# EAGLE design Mega (EAGLE 7.5.0)
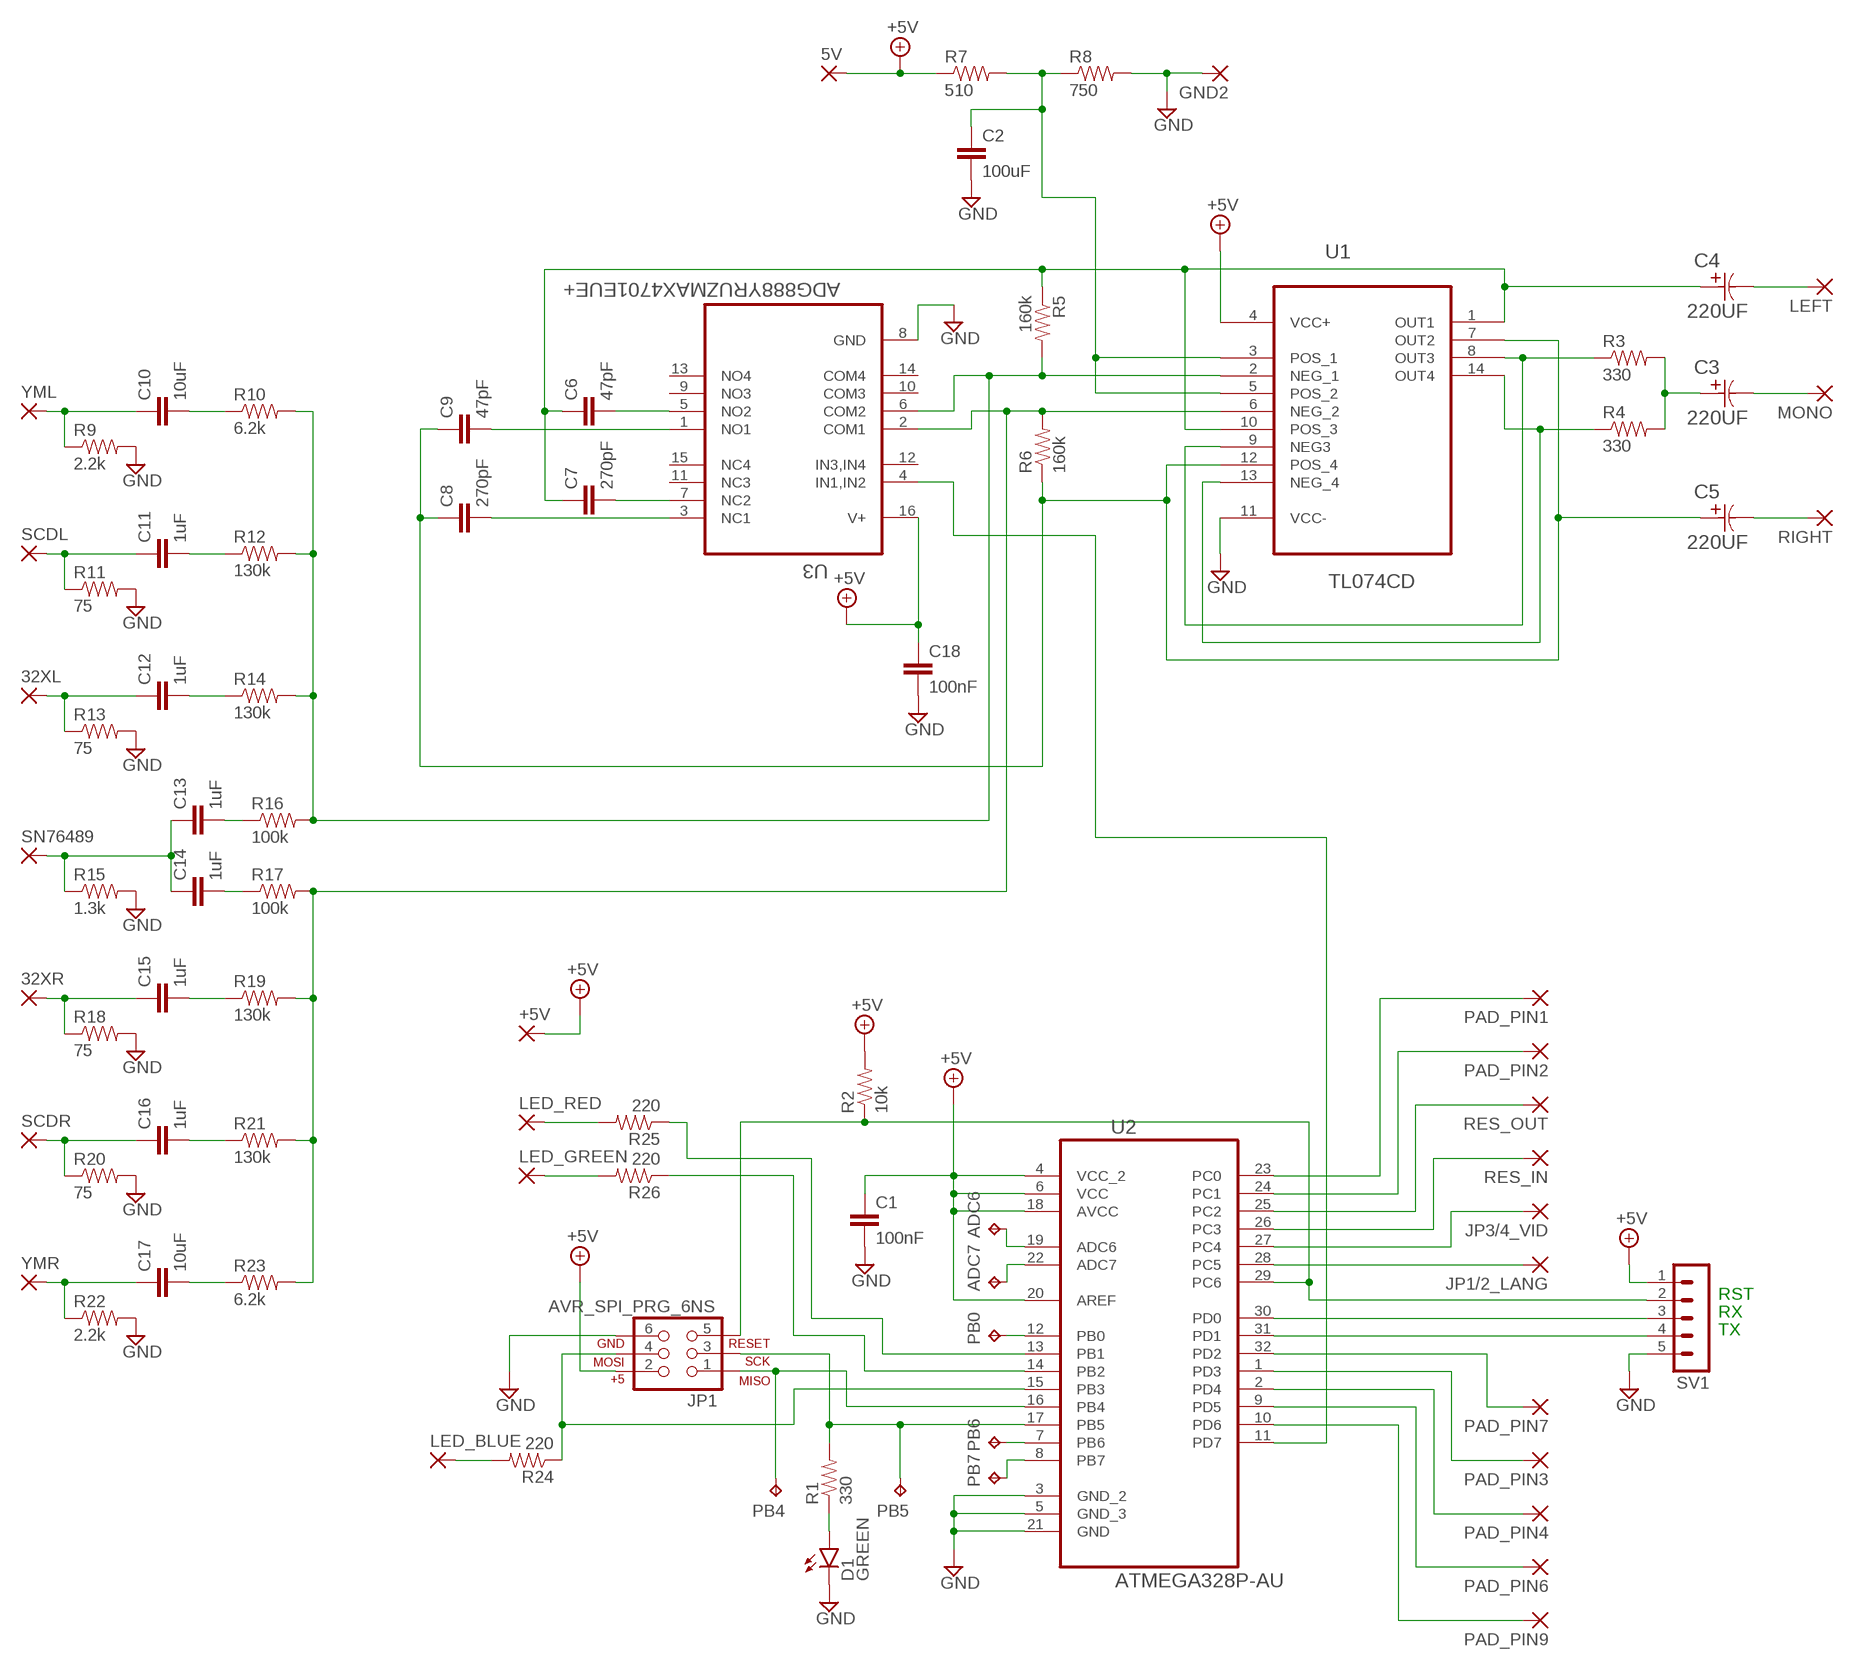
[diagram p0: schematic, sheet 1]

## Parts
5V  SMD2  [SMD1,27-2,54]
32XL  SMD2  [SMD1,27-2,54]
32XR  SMD2  [SMD1,27-2,54]
+5V  SMD2  [SMD1,27-2,54]
ADC6  TPB1,27  [B1,27]
ADC7  TPB1,27  [B1,27]
C1  100nF  CAP1206  [1206]
C2  100uF  CAP1206  [1206]
C3  220UF  EEE-FK1C221P-CASE-E  [CAPAE830X650N]
C4  220UF  EEE-FK1C221P-CASE-E  [CAPAE830X650N]
C5  220UF  EEE-FK1C221P-CASE-E  [CAPAE830X650N]
C6  47pF  CAP1206  [1206]
C7  270pF  CAP1206  [1206]
C8  270pF  CAP1206  [1206]
C9  47pF  CAP1206  [1206]
C10  10uF  CAP1206  [1206]
C11  1uF  CAP1206  [1206]
C12  1uF  CAP1206  [1206]
C13  1uF  CAP1206  [1206]
C14  1uF  CAP1206  [1206]
C15  1uF  CAP1206  [1206]
C16  1uF  CAP1206  [1206]
C17  10uF  CAP1206  [1206]
C18  100nF  CAP1206  [1206]
D1  GREEN  LED1206  [LED-1206]
GND2  SMD2  [SMD1,27-2,54]
JP1  AVR_SPI_PRG_6NS  [2X3-NS]
JP1/2_LANG  SMD2  [SMD1,27-2,54]
JP3/4_VID  SMD2  [SMD1,27-2,54]
LED_BLUE  SMD2  [SMD1,27-2,54]
LED_GREEN  SMD2  [SMD1,27-2,54]
LED_RED  SMD2  [SMD1,27-2,54]
LEFT  SMD2  [SMD1,27-2,54]
MONO  SMD2  [SMD1,27-2,54]
PAD_PIN1  SMD2  [SMD1,27-2,54]
PAD_PIN2  SMD2  [SMD1,27-2,54]
PAD_PIN3  SMD2  [SMD1,27-2,54]
PAD_PIN4  SMD2  [SMD1,27-2,54]
PAD_PIN6  SMD2  [SMD1,27-2,54]
PAD_PIN7  SMD2  [SMD1,27-2,54]
PAD_PIN9  SMD2  [SMD1,27-2,54]
PB0  TPB1,27  [B1,27]
PB4  TPB1,27  [B1,27]
PB5  TPB1,27  [B1,27]
PB6  TPB1,27  [B1,27]
PB7  TPB1,27  [B1,27]
R1  330  RESISTOR1206  [1206]
R2  10k  RESISTOR1206  [1206]
R3  330  RESISTOR1206  [1206]
R4  330  RESISTOR1206  [1206]
R5  160k  RESISTOR1206  [1206]
R6  160k  RESISTOR1206  [1206]
R7  510  RESISTOR1206  [1206]
R8  750  RESISTOR1206  [1206]
R9  2.2k  RESISTOR1206  [1206]
R10  6.2k  RESISTOR1206  [1206]
R11  75  RESISTOR1206  [1206]
R12  130k  RESISTOR1206  [1206]
R13  75  RESISTOR1206  [1206]
R14  130k  RESISTOR1206  [1206]
R15  1.3k  RESISTOR1206  [1206]
R16  100k  RESISTOR1206  [1206]
R17  100k  RESISTOR1206  [1206]
R18  75  RESISTOR1206  [1206]
R19  130k  RESISTOR1206  [1206]
R20  75  RESISTOR1206  [1206]
R21  130k  RESISTOR1206  [1206]
R22  2.2k  RESISTOR1206  [1206]
R23  6.2k  RESISTOR1206  [1206]
R24  220  RESISTOR1206  [1206]
R25  220  RESISTOR1206  [1206]
R26  220  RESISTOR1206  [1206]
RES_IN  SMD2  [SMD1,27-2,54]
RES_OUT  SMD2  [SMD1,27-2,54]
RIGHT  SMD2  [SMD1,27-2,54]
SCDL  SMD2  [SMD1,27-2,54]
SCDR  SMD2  [SMD1,27-2,54]
SN76489  SMD2  [SMD1,27-2,54]
SV1  MA05-1  [MA05-1]
U1  TL074CD  [SOIC127P600X175-14N]
U2  ATMEGA328P-AU  [QFP80P900X900X120-32N]
U3  ADG888YRUZMAX4701EUE+  [SOP65P640X120-16N]
YML  SMD2  [SMD1,27-2,54]
YMR  SMD2  [SMD1,27-2,54]

## Nets
+5V: 5V.1(P) +5V.1(P) C1.1 C18.1 JP1.2 R2.2 R7.1 SV1.1 U1.4(VCC+) U2.4(VCC_2) U2.6(VCC) U2.18(AVCC) U2.20(AREF) U3.16(V+)
GND: C1.2 C2.2 C18.2 D1.C GND2.1(P) JP1.6 R8.2 R9.2 R11.2 R13.2 R15.2 R18.2 R20.2 R22.2 SV1.5 U1.11(VCC-) U2.3(GND_2) U2.5(GND_3) U2.21(GND) U3.8(GND)
N$1: D1.A R1.1
N$2: JP1.3 PB5.TP R1.2 U2.17(PB5)
N$3: JP1.5 R2.1 SV1.2 U2.29(PC6)
N$4: JP1.1 PB4.TP U2.16(PB4)
N$5: JP1.4 R24.1 U2.15(PB3)
N$6: LED_RED.1(P) R25.2
N$7: LED_GREEN.1(P) R26.2
N$8: R3.1 U1.8(OUT3) U1.9(NEG3)
N$9: JP1/2_LANG.1(P) U2.28(PC5)
N$10: JP3/4_VID.1(P) U2.27(PC4)
N$11: R4.1 U1.13(NEG_4) U1.14(OUT4)
N$12: C3.1 R3.2 R4.2
N$13: C3.2 MONO.1(P)
N$14: C4.2 LEFT.1(P)
N$15: RES_IN.1(P) U2.26(PC3)
N$16: C4.1 C6.1 C7.1 R5.1 U1.1(OUT1) U1.10(POS_3)
N$17: C5.1 C8.1 C9.1 R6.1 U1.7(OUT2) U1.12(POS_4)
N$18: C5.2 RIGHT.1(P)
N$19: R6.2 R17.2 R19.2 R21.2 R23.2 U1.6(NEG_2) U3.2(COM1)
N$20: C6.2 U3.5(NO2)
N$21: C8.2 U3.3(NC1)
N$22: C7.2 U3.7(NC2)
N$23: C9.2 U3.1(NO1)
N$24: C10.1 R9.1 YML.1(P)
N$25: C2.1 R7.2 R8.1 U1.3(POS_1) U1.5(POS_2)
N$26: C10.2 R10.1
N$27: C11.1 R11.1 SCDL.1(P)
N$28: C11.2 R12.1
N$29: 32XL.1(P) C12.1 R13.1
N$30: C12.2 R14.1
N$31: C13.1 C14.1 R15.1 SN76489.1(P)
N$32: C13.2 R16.1
N$33: C17.1 R22.1 YMR.1(P)
N$34: C14.2 R17.1
N$35: 32XR.1(P) C15.1 R18.1
N$36: C15.2 R19.1
N$37: C16.1 R20.1 SCDR.1(P)
N$38: C16.2 R21.1
N$39: C17.2 R23.1
N$40: R5.2 R10.2 R12.2 R14.2 R16.2 U1.2(NEG_1) U3.6(COM2)
N$41: RES_OUT.1(P) U2.25(PC2)
N$42: PAD_PIN2.1(P) U2.24(PC1)
N$43: PAD_PIN1.1(P) U2.23(PC0)
N$44: SV1.4 U2.31(PD1)
N$45: SV1.3 U2.30(PD0)
N$46: PAD_PIN7.1(P) U2.32(PD2)
N$47: PAD_PIN3.1(P) U2.1(PD3)
N$48: PAD_PIN4.1(P) U2.2(PD4)
N$49: PAD_PIN6.1(P) U2.9(PD5)
N$50: PAD_PIN9.1(P) U2.10(PD6)
N$51: LED_BLUE.1(P) R24.2
N$52: R26.1 U2.14(PB2)
N$53: R25.1 U2.13(PB1)
N$54: ADC6.TP U2.19(ADC6)
N$55: ADC7.TP U2.22(ADC7)
N$56: PB0.TP U2.12(PB0)
N$57: PB6.TP U2.7(PB6)
N$58: PB7.TP U2.8(PB7)
N$59: U2.11(PD7) U3.4(IN1,IN2)
Unconnected: U3.9(NO3) U3.10(COM3) U3.11(NC3) U3.12(IN3,IN4) U3.13(NO4) U3.14(COM4) U3.15(NC4)

## Notes on the sheet
- RST
- RX
- TX

## Library data of the parts
5V 32XL 32XR +5V GND2 JP1/2_LANG JP3/4_VID LED_BLUE LED_GREEN LED_RED LEFT MONO PAD_PIN1-PAD_PIN4 PAD_PIN6 PAD_PIN7 PAD_PIN9 RES_IN RES_OUT RIGHT SCDL SCDR SN76489 YML YMR = wirepad:SMD2: SMD PAD
ADC6 ADC7 PB0 PB4-PB7 = testpad:TP: Test pad
C1 C2 C6-C18 = SparkFun-Capacitors:CAP: Capacitor Standard 0603 ceramic capacitor, and 0.1" leaded capacitor.
C3-C5 = 220uF_2106:EEE-: Aluminum Electrolytic Capacitors,Surface Mount Type; MPN: EEE-FK1C221P; OC_FARNELL: 9695680; OC_NEWARK: 96K9382; PACKAGE: CASE-E; SUPPLIER: PANASONIC; TOLERANCE: 20 %; VOLTAGERATING: 16V
D1 = SparkFun-LED:LED: LEDs Standard schematic elements and footprints for 5mm, 3mm, 1206, and 0603 sized LEDs. 5mm - Spark Fun Electronics SKU : COM-00529 (and others)
JP1 = SparkFun-Connectors:AVR_SPI_PRG_6: AVR ISP 6 Pin This is the reduced ISP connector for AVR programming. Common on Arduino. This footprint will take up less PCB space and can be used with a 10-pin to 6-pin adapter such as SKU: BOB-08508 **Special note about "TEST_POINT" package. The stop mask is on the top side, so if you want your programming test points to be on the bottom of your board, make sure to place this package on the bottom side of the board. This also ensure that the orientation to program from the bottom side will be correct.
R1-R26 = SparkFun-Resistors:RESISTOR: Resistor Basic schematic elements and footprints for 0603, 1206, and PTH resistors.
SV1 = con-lstb:MA05-1: PIN HEADER; OC_FARNELL: unknown; OC_NEWARK: unknown
U1 = TL074_SMD:TL074CD: Low noise JFET quad operational amplifier; MPN: TL074CD; OC_FARNELL: 1651878; OC_NEWARK: 89K1719; PACKAGE: SOIC-14; SUPPLIER: STMICROELECTRONICS
U2 = Atmega328P:ATMEGA328P-AU: 8-bit Microcontroller with In-System Programmable Flash; MPN: ATMEGA328P-AU; OC_FARNELL: 1715486; OC_NEWARK: 14R4631; PACKAGE: TQFP-32; SUPPLIER: Atmel
U3 = MAX4701EUE+:ADG888YRUZ: 0.4 Ù CMOS, Dual DPDT Switch

## Board
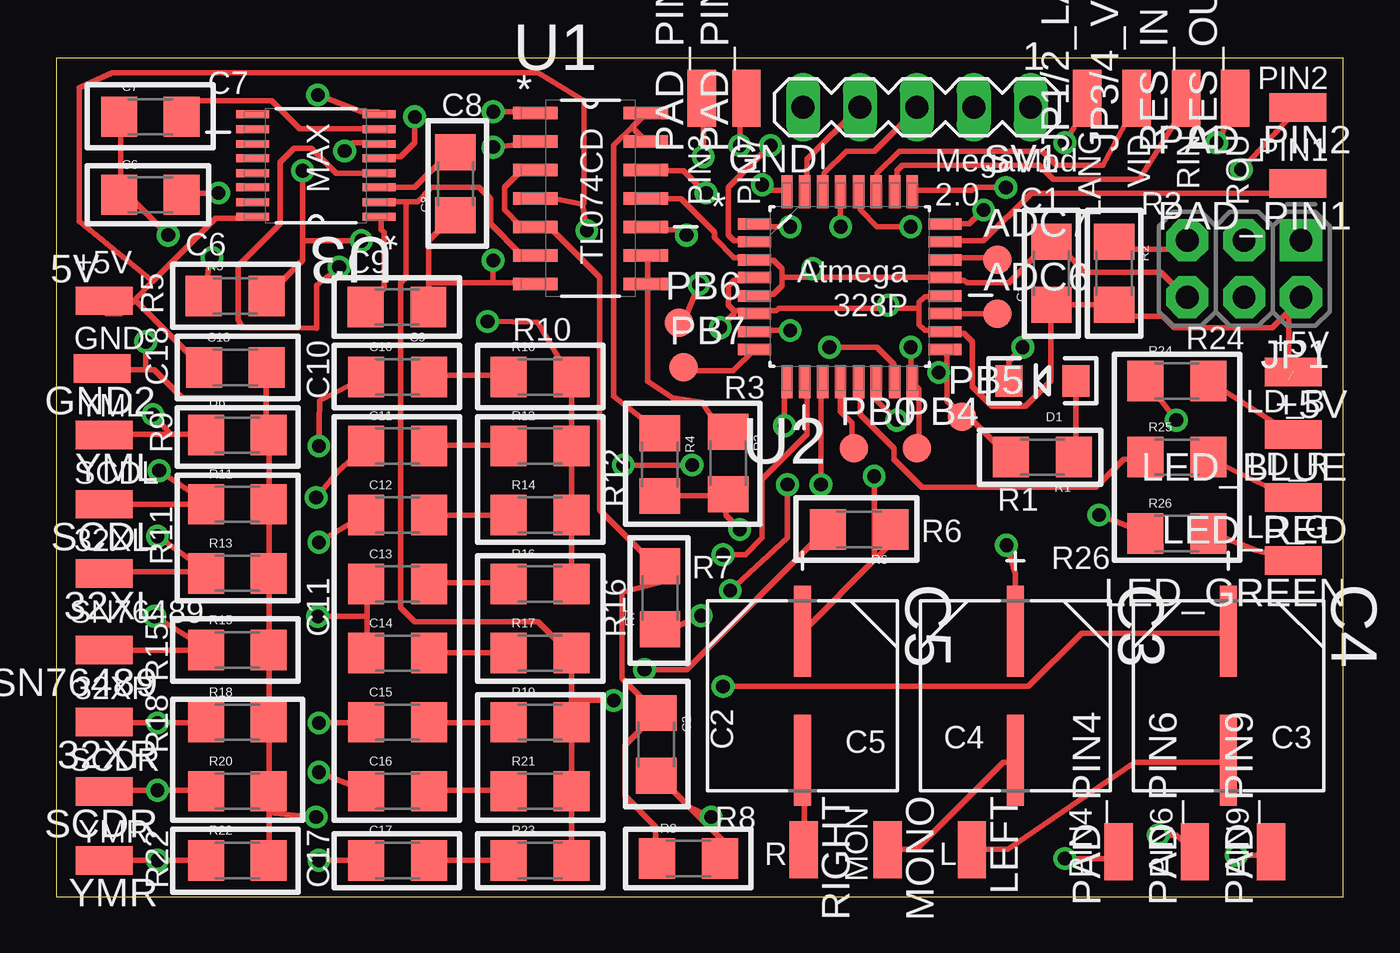
[diagram p1: board, top side]
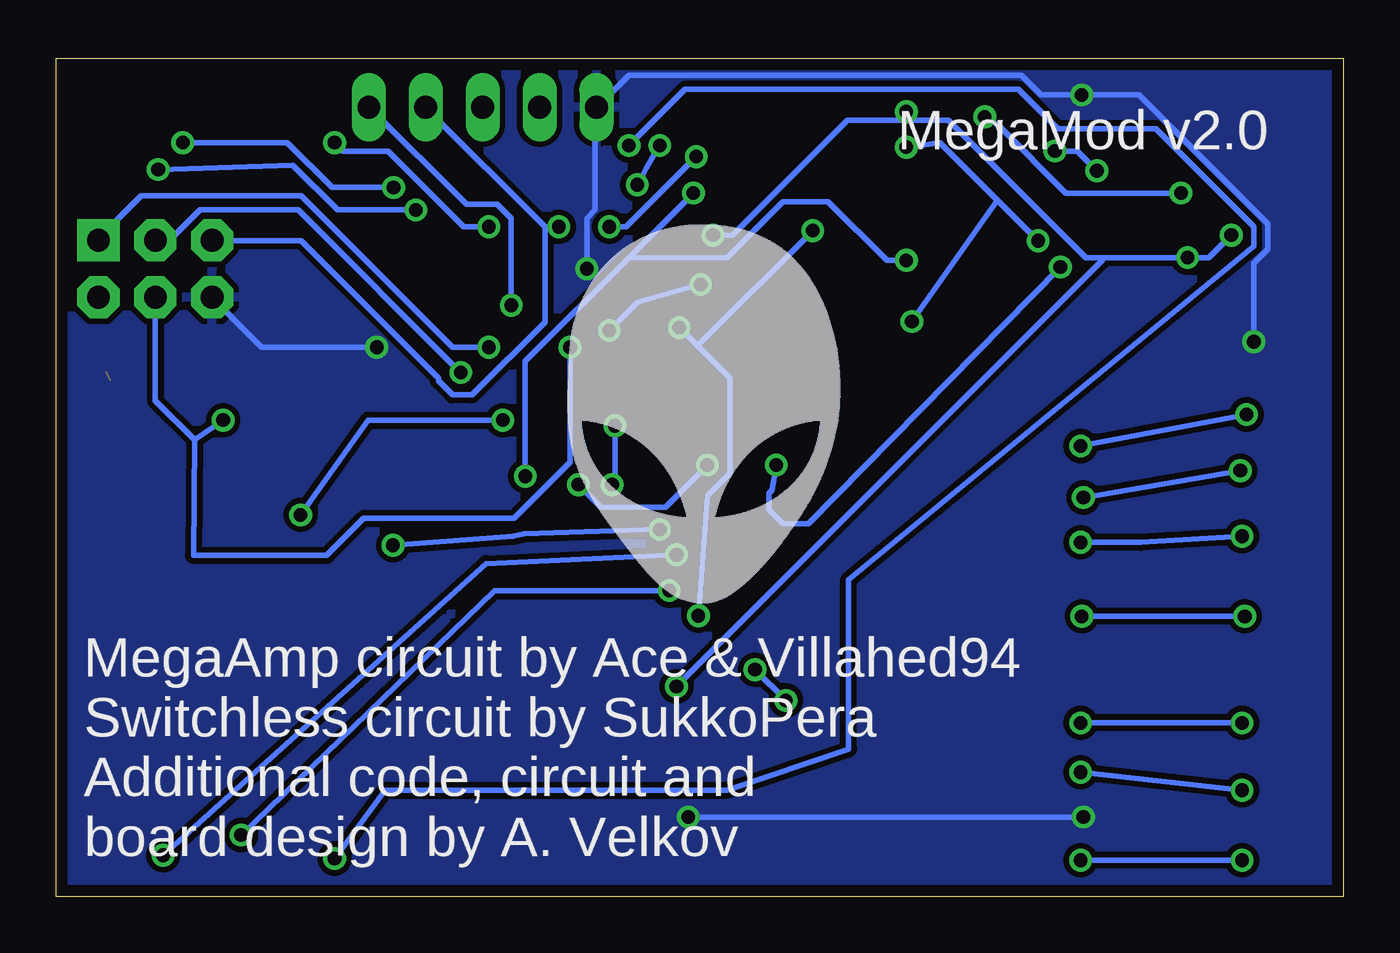
[diagram p2: board, bottom side, seen from below]

Size 57.43 x 37.39 mm. Coordinates in mm from the lower left corner, seen from the top.
Outline: 0,0 57.43,0 57.43,37.39 0,37.39 0,0
Copper layers (1*16): Top 0.035mm / dielectric 1.5mm / Bottom 0.035mm
Design rules "default *": minimum track width 10mil, minimum drill 24mil, track to track 10mil, track to pad 10mil, pad to pad 10mil, via to via 10mil, smd to smd 8mil, copper to edge 20mil, drill to drill 8mil, minimum pad ring 10mil, minimum via ring 8mil, stop-mask expansion 4mil, vias tented up to drill 25mil, thermal gap 10mil

### Footprints (pad centres in the part's own frame; a part is rotated, then mirrored left to right if it is on the bottom)
SMD1,27-2,54 = smd 1.27 x 2.54: 1 0,0
B1,27 = smd 1.27 x 1.27: TP 0,0
1206 = smd 1.6 x 1.8: 1 -1.4,0; 2 1.4,0
CAPAE830X650N = smd 4.064 x 0.762: 1 -2.87,0; 2 2.87,0
LED-1206 = smd 1.2 x 1.4: A -1.5,0; C 1.5,0
2X3-NS = drill 1.016 pad 1.88 square: 1 -2.54,-1.27 | drill 1.016 pad 1.88 octagon: 2 -2.54,1.27; 3 0,-1.27; 4 0,1.27; 5 2.54,-1.27; 6 2.54,1.27
MA05-1 = drill 1.016 long: 1 -5.08,0; 2 -2.54,0; 3 0,0; 4 2.54,0; 5 5.08,0
SOIC127P600X175-14N = smd 1.981 x 0.559: 1 -2.464,3.81; 2 -2.464,2.54; 3 -2.464,1.27; 4 -2.464,0; 5 -2.464,-1.27; 6 -2.464,-2.54; 7 -2.464,-3.81; 8 2.464,-3.81; 9 2.464,-2.54; 10 2.464,-1.27; 11 2.464,0; 12 2.464,1.27; 13 2.464,2.54; 14 2.464,3.81
QFP80P900X900X120-32N = smd 1.473 x 0.508: 1 -4.242,2.794; 2 -4.242,2.007; 3 -4.242,1.194; 4 -4.242,0.406; 5 -4.242,-0.406; 6 -4.242,-1.194; 7 -4.242,-2.007; 8 -4.242,-2.794; 17 4.242,-2.794; 18 4.242,-2.007; 19 4.242,-1.194; 20 4.242,-0.406; 21 4.242,0.406; 22 4.242,1.194; 23 4.242,2.007; 24 4.242,2.794 | smd 0.508 x 1.473: 9 -2.794,-4.242; 10 -2.007,-4.242; 11 -1.194,-4.242; 12 -0.406,-4.242; 13 0.406,-4.242; 14 1.194,-4.242; 15 2.007,-4.242; 16 2.794,-4.242; 25 2.794,4.242; 26 2.007,4.242; 27 1.194,4.242; 28 0.406,4.242; 29 -0.406,4.242; 30 -1.194,4.242; 31 -2.007,4.242; 32 -2.794,4.242
SOP65P640X120-16N = smd 1.473 x 0.356: 1 -2.819,2.286; 2 -2.819,1.626; 3 -2.819,0.965; 4 -2.819,0.33; 5 -2.819,-0.33; 6 -2.819,-0.965; 7 -2.819,-1.626; 8 -2.819,-2.286; 9 2.819,-2.286; 10 2.819,-1.626; 11 2.819,-0.965; 12 2.819,-0.33; 13 2.819,0.33; 14 2.819,0.965; 15 2.819,1.626; 16 2.819,2.286

### Placement (x,y rotation side)
5V  2.14,26.57 270 top
32XL  2.14,14.42 90 top
32XR  2.14,7.78 90 top
+5V  55.2,23.4 90 top
ADC6  42,26 0 top
ADC7  42,28.4 0 top
C1  44.4,27.8 90 top
C2  26.78,6.79 270 top
C3  42.8,8.96 270 top
C4  52.3,8.96 270 top
C5  33.3,8.96 270 top
C6  4.21,31.3 0 top
C7  4.21,34.78 0 top
C8  17.82,31.79 90 top
C9  15.21,26.3 180 top
C10  15.24,23.18 0 top
C11  15.24,20.1 0 top
C12  15.24,17.02 0 top
C13  15.24,13.94 0 top
C14  15.24,10.86 0 top
C15  15.24,7.78 0 top
C16  15.24,4.7 0 top
C17  15.24,1.62 0 top
C18  8,23.6 0 top
D1  44,23 180 top
GND2  2.06,23.56 90 top
JP1  53,28 180 top
JP1/2_LANG  46,35.6 0 top
JP3/4_VID  48.2,35.6 0 top
LED_BLUE  55.2,20.6 90 top
LED_GREEN  55.2,15 90 top
LED_RED  55.2,17.8 90 top
LEFT  40.85,2.1 180 top
MONO  37.1,2.1 180 top
PAD_PIN1  55.4,31.8 90 top
PAD_PIN2  55.4,35.2 90 top
PAD_PIN3  28.8,35.6 0 top
PAD_PIN4  47.4,2 0 top
PAD_PIN6  50.8,2 0 top
PAD_PIN7  30.8,35.6 0 top
PAD_PIN9  54.2,2 0 top
PB0  35.6,20 0 top
PB4  38.4,20 0 top
PB5  40.4,21.4 0 top
PB6  27.8,25.6 0 top
PB7  28,23.6 0 top
R1  44,19.6 180 top
R2  47.2,27.8 270 top
R3  29.98,19.34 270 top
R4  26.93,19.27 270 top
R5  7.99,26.78 0 top
R6  35.83,16.38 180 top
R7  26.94,13.33 90 top
R8  28.21,1.7 0 top
R9  8.09,20.58 0 top
R10  21.59,23.18 0 top
R11  8.09,17.5 0 top
R12  21.59,20.1 0 top
R13  8.09,14.42 0 top
R14  21.59,17.02 0 top
R15  8.09,11 0 top
R16  21.59,13.94 0 top
R17  21.59,10.86 0 top
R18  8.09,7.78 0 top
R19  21.59,7.78 0 top
R20  8.09,4.7 0 top
R21  21.59,4.7 0 top
R22  8.09,1.62 0 top
R23  21.59,1.62 0 top
R24  50,23 0 top
R25  50,19.6 0 top
R26  50,16.2 0 top
RES_IN  50.4,35.6 0 top
RES_OUT  52.6,35.6 0 top
RIGHT  33.34,2.1 180 top
SCDL  2.14,17.5 90 top
SCDR  2.14,4.7 90 top
SN76489  2.14,11 90 top
SV1  38.4,35.2 180 top
U1  23.84,31.14 0 top
U2  35.4,27.2 0 top
U3  11.6,32.6 180 top
YML  2.14,20.58 90 top
YMR  2.14,1.62 90 top

### Tracks (layer width: path | path; a pad name or v marks a point on that pad's centre or on a via)
+5V  (via drill 0.61)  (1 unrouted)
  Top 0.254: 55.5,26.62 54.25,25.38 49.88,25.38 49.38,25.88 47.25,25.88 R2.2 C1.1 44.38,25.88 44.38,23 43.25,21.88 41.75,21.88 40.88,22.75 40.88,24.75 40.5,25.12 39.75,25.12 U2.18 39.62,25.25 38.75,25.25 38.5,25.5 38.5,26.25 | 55.5,26.62 JP1.2 | 3.5,26.62 2.88,26 2.25,26 5V.1 | 3.5,26.62 4.31,27.44 | 4.31,27.44 7.12,30.25 8.75,30.25 U3.16 | 3.5,26.62 6.5,23.62 C18.1 | 38.5,26.25 38.5,26.5 38.75,26.75 39.62,26.75 U2.20 | 30.25,26.12 31.12,26.12 U2.6 31.25,26.12 32.12,26.12 32.25,26.25 37.12,26.25 | 30.25,26.12 30,26.38 30,27.25 30.25,27.5 31.12,27.5 U2.4 | v28.77,12.53 27,11.75 R7.1 | v29.62,25.38 30.25,26 30.25,26.12 | v23.68,29.7 23.49,30.89 | 23.49,30.89 22.25,31.12 21.5,31.12 U1.4 | 37.12,26.25 38.5,26.25 | v37.12,26.38 37.12,26.25 | 4.31,27.44 1.02,30.12 1.02,36.08 2.5,36.75 21.5,36.75 23.55,35.5 23.55,30.95 23.49,30.89 | 55.5,26.62 55,26.23 55,23
  Bottom 0.254: v28.77,12.53 28.38,17.88 27.38,18.88 27.38,23.12 28.81,24.56 | v29.62,25.38 28.81,24.56 | 28.81,24.56 v23.68,29.7 | v37.12,26.38 37.12,30.25 37.75,30.88 39.12,30.88 43.38,35.12 SV1.1
GND  (via drill 0.61)
  Top 0.254: 9.38,22.25 9.38,20.62 R9.2 9.5,20.5 9.5,17.62 R11.2 9.5,14.5 R13.2 9.5,14.38 9.5,11.12 R15.2 9.5,7.88 R18.2 9.5,7.75 9.5,4.75 R20.2 9.5,4.62 9.5,3.75 | 9.38,22.25 9.38,23.5 C18.2 | 4,23.5 4.38,23.5 5.62,22.25 9.38,22.25 | 4,23.5 2.12,23.5 GND2.1 | 28.26,3.99 26.88,5.38 C2.2 | 28.26,3.99 29.7,2.55 29.5,1.75 R8.2 | 9.5,3.75 R22.2 | v29.23,3.55 28.26,3.99 | 9.5,3.75 v11.6,3.55 | v11.68,35.75 13.62,35 14.38,35 U3.8 | D1.C 42.5,23.88 v43.12,24.5 | JP1.6 50.38,26.75 49.27,27.85 45.9,27.85 45,28.75 44.5,28.75 C1.2 44.38,28.75 43.88,28.75 42.5,27.38 40.62,27.38 40.5,27.5 39.75,27.5 U2.21 39.62,27.62 33.75,27.62 | 32.38,27.62 32.38,28 32,28.38 31.25,28.38 U2.3 31.12,28.5 30.25,28.5 29.38,29.38 29.38,29.62 27.88,31.12 26.38,31.12 U1.11 | 32.38,27.62 32.38,27.25 32,26.88 31.25,26.88 U2.5 | 32.38,27.62 33.75,27.62 | 33.75,27.62 v33.75,28 | v4,24.75 4,23.5
  Bottom 0.254: v11.6,3.55 v29.23,3.55 | v43.12,24.5 48.25,24.5 50.38,26.62 JP1.6 | v33.75,28 33.75,30.25 33.38,30.62 33.38,35.12 SV1.5 33.25,35.25 31.88,36.62 14.38,36.62 13.5,35.75 v11.68,35.75 9.12,35.75 3.38,30 3.38,28.88 4,28.25 v4,24.75
  pour Bottom: -0.6,-0.2 -0.6,38.2 57.8,38.6 57.6,0
N$1
  Top 0.254: D1.A 45.5,19.62 R1.1
N$2  (via drill 0.61)
  Top 0.254: R1.2 42.5,19.62 40.75,21.38 40.5,21.38 PB5.TP 40.38,21.5 39.75,22.12 39.75,23.38 | 39.75,23.38 39.75,24.38 U2.17 | 39.75,23.38 v39.38,23.38
  Bottom 0.254: v39.38,23.38 46.62,30.62 51,30.62 52.25,29.38 53,29.38 JP1.3
N$3  (via drill 0.61)
  Top 0.254: R2.1 47.25,28.88 50,28.88 50.38,29.25 JP1.5 | v35,29.88 35,31.38 U2.29
  Bottom 0.254: 35.62,29.88 v35,29.88 | 35.62,29.88 40.88,35.12 SV1.2 | 35.62,29.88 35.62,25.62 38.88,22.38 39.75,22.38 40.38,23 40.38,23.12 46.5,29.25 50.38,29.25 JP1.5
N$4  (via drill 0.61)
  Top 0.254: PB4.TP 38.5,20 38.5,22.62 38.25,22.88 U2.16 38.12,23 v38.12,24.5
  Bottom 0.254: v38.12,24.5 39.75,24.5 46.5,31.25 53.62,31.25 55.5,29.38 JP1.1
N$5  (via drill 0.61)
  Top 0.254: v34.5,24.5 36.62,24.5 37.38,23.75 37.38,23 U2.15 | v49.98,21.25 48.62,23 R24.1
  Bottom 0.254: v34.5,24.5 34.5,19.38 37,16.88 43.7,16.88 45.35,15.22 51.3,15.22 51.25,20.38 | 51.25,20.38 53,22.12 JP1.4 | 51.25,20.38 v49.98,21.25
N$6
  Top 0.254: R25.2 51.3,19.62 54.12,18.23 LED_RED.1
N$7
  Top 0.254: R26.2 51.5,16.25 53.52,15.45 LED_GREEN.1
N$8
  Top 0.254: R3.1 29.88,20.75 29.52,20.95 28.82,22.05 27.5,22.25 26.38,22.98 26.38,27.25 U1.8 26.38,27.38 26.38,28.5 U1.9
N$9  (via drill 0.61)
  Top 0.254: v38.12,29.88 36.62,29.88 35.88,30.62 35.88,31.38 U2.28 | v45,33.62 45.4,34.3 46,35.5 JP1/2_LANG.1
  Bottom 0.254: v38.12,29.88 39.25,29.88 42.62,33.25 44.62,33.25 v45,33.62
N$10
  Top 0.254: U2.27 36.62,31.5 36.62,32.25 37.62,33.25 44,33.25 44.62,32.62 46.7,32.62 48.12,35.25 48.12,35.5 JP3/4_VID.1
N$11
  Top 0.254: 25.69,34.31 26.25,34.88 U1.14 | 25.69,34.31 24.88,33.5 24.88,22.32 26.88,20.75 R4.1 | 25.69,34.31 26.25,33.75 U1.13
N$12  (via drill 0.61)
  Top 0.254: R4.2 27,17.88 29.88,17.88 R3.2 29.88,17.75 29.88,17 v30.5,16.38 | v42.4,15.68 42.8,14.43 42.75,11.88 C3.1
  Bottom 0.254: v30.5,16.38 36.55,16.18 37.05,16.07 v42.4,15.68
N$13
  Top 0.254: MONO.1 37.12,2.12 38.38,2.12 42.25,6 42.75,6 C3.2
N$14
  Top 0.254: LEFT.1 40.88,2.12 42.45,2.12 48.12,6 52.25,6 C4.2
N$15
  Top 0.254: U2.26 37.5,31.5 37.5,32.38 37.75,32.62 43.88,32.62 44.5,32 48.33,32 50.38,35.25 50.38,35.5 RES_IN.1
N$16  (via drill 0.61)
  Top 0.254: C7.1 2.88,34.75 2.88,31.38 C6.1 3,31.5 v5,29.5 | v6.95,28.5 6.83,28.18 6.62,26.88 R5.1 | v28.12,29.5 27.88,29.75 26.38,29.75 U1.10 | v19.5,35 21.38,35 U1.1 | v29.75,9.38 43.38,9.38 45.75,11.75 52.25,11.75 C4.1
  Bottom 0.254: v5,29.5 6,28.5 v6.95,28.5 10.75,28.5 | v28.12,29.5 27.25,29.5 22.12,34.62 19.5,34.62 | 19.5,34.62 17.62,34.62 11.5,28.5 10.75,28.5 | 19.5,34.62 v19.5,35 | v29.75,9.38 10.75,28.38 10.75,28.5
N$17  (via drill 0.61)
  Top 0.254: 16.62,27.38 16.62,29.25 17.75,30.38 C8.1 | 16.62,27.38 16.62,26.38 C9.1 | 16.62,27.38 19.5,27.38 | 19.5,27.38 21.38,27.38 U1.7 | 36.56,15.06 33.38,11.88 C5.1 | 36.56,15.06 37.12,15.62 37.12,16.38 R6.1 | v29,31.38 28,32.38 26.38,32.38 U1.12 | v36.5,18.75 36.5,15.12 36.56,15.06 | v19.5,28.38 19.5,27.38
  Bottom 0.254: 31.81,28.56 36.5,23.88 v36.5,18.75 | 31.81,28.56 v29,31.38 | v19.5,28.38 20.38,28.38 23,31 25,31 27.5,28.5 31.75,28.5 31.81,28.56
N$18
  Top 0.254: RIGHT.1 33.38,2.12 33.38,6 C5.2
N$19  (via drill 0.61)
  Top 0.254: 15.62,31 16.12,31 16.75,31.62 18.88,31.62 19.38,31.12 19.38,30 20.75,28.62 21.38,28.62 U1.6 | 15.62,31 14.5,31 U3.2 | R23.2 23,4.62 R21.2 23,4.75 23,7.75 R19.2 23,7.88 23,8.75 | 23,8.75 23,10.75 R17.2 22.88,10.88 21.5,12.25 16,12.25 15.38,12.88 15.38,27.38 15.62,27.62 15.62,31 | v26.25,10.12 28.12,10.12 34.38,16.38 R6.2 | 23,8.75 v24.88,8.75
  Bottom 0.254: v24.88,8.75 v26.25,10.12
N$20  (via drill 0.61)
  Top 0.254: v16,34.77 16,33.62 15.38,33 14.5,33 U3.5 | v7.25,31.38 5.62,31.38 C6.2
  Bottom 0.254: v16,34.77 15.38,34.38 12.38,31.38 v7.25,31.38
N$21
  Top 0.254: U3.3 14.5,31.62 16,31.62 17.5,33.12 17.75,33.12 C8.2
N$22
  Top 0.254: U3.7 14.38,34.25 10.88,34.25 9.62,35.5 6.25,35.5 5.62,34.88 C7.2
N$23
  Top 0.254: U3.1 14.5,30.25 14.5,29.75 14.62,29.62 14.62,27.12 13.88,26.38 C9.2
N$24  (via drill 0.61)
  Top 0.254: 5.12,20.62 2.25,20.62 YML.1 | 5.12,20.62 6.62,20.62 R9.1 | v11.72,20.1 11.75,22.12 C10.1 | v4.33,21.5 5.12,20.62
  Bottom 0.254: v4.33,21.5 v11.72,20.1
N$25
  Top 0.254: U1.3 21.38,32.38 20.75,32.38 20,31.62 20,30.62 20.75,29.88 U1.5 21.5,29.75 22.12,29.75 24.25,27.62 24.25,17.25 26.88,14.62 R7.2 26.88,14.5 26.88,14 25.25,13.57 25.25,9.75 26.75,8.25 C2.1 26.75,8.12 25.38,6.75 25.38,4.5 26.75,3.12 26.75,1.75 R8.1
N$26
  Top 0.254: C10.2 16.75,23.25 20.12,23.25 R10.1
N$27  (via drill 0.61)
  Top 0.254: SCDL.1 R11.1 6.62,17.62 v4.6,19 | v11.6,17.8 12.6,19 13.75,20 C11.1
  Bottom 0.254: v4.6,19 v11.6,17.8
N$28
  Top 0.254: C11.2 16.75,20.12 20.12,20.12 R12.1
N$29  (via drill 0.61)
  Top 0.254: 32XL.1 2.25,14.5 6.62,14.5 R13.1 6.75,14.5 v4.53,16.07 | v11.72,15.8 13.75,17 C12.1
  Bottom 0.254: v11.72,15.8 9.05,15.8 v4.53,16.07
N$30
  Top 0.254: C12.2 16.75,17 20.12,17 R14.1
N$31  (via drill 0.61)
  Top 0.254: 13.88,12.5 13.88,13.88 C13.1 | 13.88,12.5 13.88,10.88 C14.1 | SN76489.1 R15.1 6.62,11.12 v4.4,12.5 | v11.68,12.5 13.88,12.5
  Bottom 0.254: v4.4,12.5 v11.68,12.5
N$32
  Top 0.254: C13.2 16.75,14 20.12,14 R16.1
N$33  (via drill 0.61)
  Top 0.254: R22.1 6.62,1.62 v4.53,1.62 2.25,1.62 YMR.1 | v11.72,1.62 13.75,1.62 C17.1
  Bottom 0.254: v4.53,1.62 v11.72,1.62
N$34
  Top 0.254: C14.2 16.75,10.88 20.12,10.88 R17.1
N$35  (via drill 0.61)
  Top 0.254: R18.1 6.62,7.75 v4.53,7.75 2.25,7.75 32XR.1 | v11.72,7.75 13.75,7.75 C15.1
  Bottom 0.254: v4.53,7.75 v11.72,7.75
N$36
  Top 0.254: C15.2 16.75,7.75 20.12,7.75 R19.1
N$37  (via drill 0.61)
  Top 0.254: R20.1 6.62,4.75 v4.53,4.75 2.25,4.75 SCDR.1 | v11.72,5.55 13.75,4.75 C16.1
  Bottom 0.254: v4.53,4.75 v11.72,5.55
N$38
  Top 0.254: C16.2 16.75,4.75 20.12,4.75 R21.1
N$39
  Top 0.254: C17.2 16.75,1.62 20.12,1.62 R23.1
N$40  (via drill 0.61)
  Top 0.254: R16.2 23,14 23,17 R14.2 23,17.12 23,20 R12.2 23,20.12 23,23.12 R10.2 22.88,23.25 21.48,25.62 v19.25,25.65 | v12.88,33.25 13.25,33.62 14.38,33.62 U3.6 | 11,29.25 11,28.38 9.5,26.88 R5.2 | 11,29.25 v11,32.38 | v19.5,33.42 21.38,33.62 U1.2 | 11,29.25 v13.62,29.25
  Bottom 0.254: v12.88,33.25 11.88,33.25 v11,32.38 | v19.5,33.42 18,33.62 15.44,31.06 | v13.62,29.25 15.44,31.06 | 15.44,31.06 v19.25,25.65
N$41  (via drill 0.61)
  Top 0.254: v42.38,31.62 41,31.62 40.88,31.5 38.25,31.5 U2.25 | v51.77,33.62 51.98,33.92 52.5,35.25 52.5,35.5 RES_OUT.1
  Bottom 0.254: v42.38,31.62 45.12,31.62 47.12,33.62 v51.77,33.62
N$42  (via drill 0.61)
  Top 0.254: v41.38,30.62 40.75,30 39.75,30 U2.24 | v52.88,32.42 55.38,35.12 PAD_PIN2.1
  Bottom 0.254: v41.38,30.62 44.88,30.62 46.88,32.62 v52.88,32.42
N$43
  Top 0.254: U2.23 39.75,29.25 41.38,29.25 43.5,31.38 55,31.38 55.38,31.75 PAD_PIN1.1
N$44
  Top 0.254: U2.31 33.5,31.5 33.5,32.88 35.75,35.12 SV1.4
N$45
  Top 0.254: U2.30 34.25,31.5 34.25,32.25 35.25,33.25 36.5,33.25 38.38,35.12 SV1.3
N$46  (via drill 0.61)
  Top 0.254: v31.5,31.75 31.75,31.5 32.5,31.5 U2.32 | v30.5,33.5 30.5,35.25 30.75,35.5 PAD_PIN7.1
  Bottom 0.254: v31.5,31.75 31.1,32.5 v30.5,33.5
N$47  (via drill 0.61)
  Top 0.254: v32.75,29.88 31.25,29.88 U2.1 | v28.88,33 28.88,35.5 PAD_PIN3.1
  Bottom 0.254: v32.75,29.88 32,29.88 v28.88,33
N$48  (via drill 0.61)
  Top 0.254: v31.88,33.5 30,31.62 30,29.5 30.25,29.25 31.12,29.25 U2.2 | v45,1.7 47.48,1.7 47.38,2 PAD_PIN4.1
  Bottom 0.254: v31.88,33.5 29.38,36 14.5,36 12.75,34.25 8.38,34.25 4,29.88 4,29 22.07,14.12 22.07,6.58 27.5,4.75 42.75,4.75 v45,1.7
N$49  (via drill 0.61)
  Top 0.254: v32.5,21 32.5,22.88 U2.9 | v32.62,18.38 32.62,16 v30.07,13.65 | v49.17,2.75 50,2.75 50.75,2 PAD_PIN6.1
  Bottom 0.254: v32.5,21 32.5,18.5 v32.62,18.38 | v30.07,13.65 37.88,13.65 v49.17,2.75
N$50  (via drill 0.61)
  Top 0.254: v29.75,15.25 30.75,15.25 31.5,16 31.5,18.62 33.5,20.62 33.5,22.88 U2.10 | v52.65,1.85 54.3,1.85 54.25,2 PAD_PIN9.1
  Bottom 0.254: v29.75,15.25 38.25,14.85 v52.65,1.85
N$51
  Top 0.254: LED_BLUE.1 R24.2
N$52  (via drill 0.61)
  Top 0.254: v37.5,21.25 36.62,22.12 36.62,22.88 U2.14 | v46.52,17.02 48.5,16.25 R26.1
  Bottom 0.254: v37.5,21.25 43.5,21.25 v46.52,17.02
N$53
  Top 0.254: U2.13 35.88,22.88 35.88,21.5 37.38,20 37.38,19.5 38.62,18.25 46.38,18.25 47.62,19.5 48.5,19.5 R25.1
N$54
  Top 0.254: ADC6.TP 39.75,26 U2.19
N$55
  Top 0.254: ADC7.TP 42,28.5 39.75,28.5 U2.22
N$56
  Top 0.254: PB0.TP 35.5,20 35.5,21.12 35,21.62 35,22.88 U2.12
N$57  (via drill 0.61)
  Top 0.254: PB6.TP 28,25.62 v28.68,27.3 | v32.75,25.25 31.25,25.25 U2.7
  Bottom 0.254: v28.68,27.3 31.5,26.5 v32.75,25.25
N$58
  Top 0.254: PB7.TP 28.4,23.45 30.2,23.45 31.12,24.38 U2.8
N$59  (via drill 0.61)
  Top 0.254: v34.12,18.38 34.12,22.88 U2.11 | v25.3,19.25 v28.38,19.25 | v12.62,28.07 11.62,27.27 11.62,25.35 10.25,25.38 8.3,25.38 8.12,25.75 8.12,28.12 10,30 10,32.75 10.62,33.38 11.38,33.38 12.5,32.25 14.38,32.25 U3.4
  Bottom 0.254: v34.12,18.38 33.12,17.38 30.25,17.38 v28.38,19.25 | v25.3,19.25 25.5,18.12 25.62,18 25.62,17.25 25,16.62 23.88,16.62 v12.62,28.07

### Text on the board
tPlace: C7 | PIN2 | C8 | PIN3 | PIN7 | LANG | VID | RIN | ROU | PIN1 | MAX | MegaMod / 2.0 | C1 | C6 | R2 | +5V | C9 | TL074CD | Atmega / 328P | R5 | R10 | +5V | GND | R24 | C18 | LD_B | C10 | R3 | YML | R9 | R12 | LD_R | SCDL | R1 | LD_G | R6 | 32XL | R11 | R7 | R26 | R16 | SN76489 | C11 | R15 | 32XR | C2 | C4 | C3 | SCDR | R18 | C5 | MON | PIN4 | PIN6 | PIN9 | R22 | R8 | YMR | R | L | C17
bPlace: MegaMod v2.0 | MegaAmp circuit by Ace & Villahed94 / Switchless circuit by SukkoPera / Additional code, circuit and / board design by A. Velkov | C:/Users/Antonio/Desktop/alien-head-stencle.bmp | C:/Users/Antonio/Desktop/alien-head-stencle.bmp